# Altium project XJTLU_Torpedo.PrjPcb
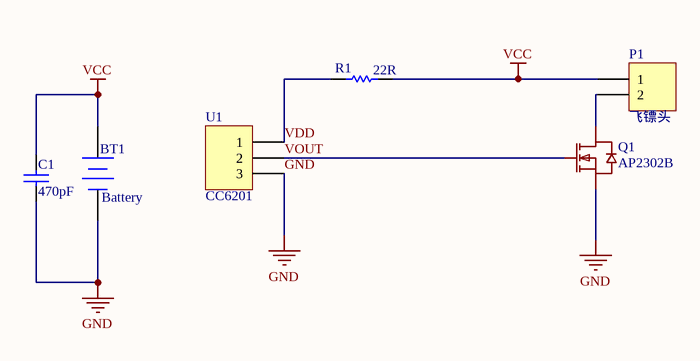
[diagram p0: XJTLU_Torpedo.SchDoc]
1 sheet, 6 parts. Net scope: global (net labels, ports and power ports of the same name join across sheets).
Board file: XJTLU_Torpedo.PcbDoc

## Sheet XJTLU_Torpedo.SchDoc
size A; SheetNumber: 1; SheetTotal: 1

### Parts
BT1  Battery  [BAT-2]
C1  value 470pF  [C0603]  (hidden comment: Cap)
P1  飞镖头  [BAT-2]
Q1  AP2302B  [SOT-23-3]
R1  value 22R  [R0603]  (hidden comment: Res1)
U1  CC6201  [TSOT-23-3]

### Nets
GND: BT1.2(-) C1.1 Q1.2(S) U1.3
VCC: BT1.1(+) C1.2 P1.1 R1.1
VDD: R1.2 U1.1
VOUT: Q1.1(G) U1.2
NetP1_2: P1.2 Q1.3(D)

### Library data of the parts
BT1 = Battery: Multicell Battery; Published: 24-Mar-1999; LatestRevisionDate: 17-Jul-2002; LatestRevisionNote: Re-released for DXP Platform.; PackageReference: BAT-2; Publisher: Altium Limited; PackageDescription: Battery; 2 Leads
C1 = Cap: Capacitor; Published: 8-Jun-2000; LatestRevisionDate: 17-Jul-2002; LatestRevisionNote: Re-released for DXP Platform.; PackageReference: RAD-0.3; Publisher: Altium Limited; PackageDescription: Radial Cap, Thru-Hole; 2 Leads; 0.3 in Pin Spacing
P1 = Header 2: Header, 2-Pin; LatestRevisionDate: 17-Jul-2002; LatestRevisionNote: Re-released for DXP Platform.; Publisher: Altium Limited
Q1 = AP2302BI: 20V N-Channel Enhancement Mode MOSFET
R1 = Res1: Resistor; Published: 8-Jun-2000; LatestRevisionDate: 17-Jul-2002; LatestRevisionNote: Re-released for DXP Platform.; PackageReference: AXIAL-0.3; Publisher: Altium Limited; PackageDescription: Axial Device, Thru-Hole; 2 Leads; 0.3 in Pin Spacing
U1 = Header 3: Header, 3-Pin; LatestRevisionDate: 17-Jul-2002; LatestRevisionNote: Re-released for DXP Platform.; Publisher: Altium Limited